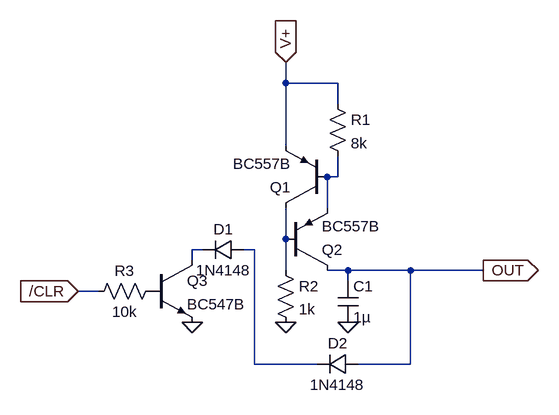
[diagram p0: schematic RampGen.asc]
RampGen.asc, the LTspice schematic file:
Version 4
SHEET 1 1276 1184
WIRE 832 -64 832 -96
WIRE 912 -64 832 -64
WIRE 912 -32 912 -64
WIRE 832 32 832 -64
WIRE 912 80 912 48
WIRE 912 80 896 80
WIRE 896 128 896 80
WIRE 832 176 832 128
WIRE 704 192 688 192
WIRE 784 192 768 192
WIRE 688 208 688 192
WIRE 832 224 832 176
WIRE 928 224 896 224
WIRE 1024 224 928 224
WIRE 1136 224 1024 224
WIRE 928 240 928 224
WIRE 544 256 512 256
WIRE 784 368 784 192
WIRE 880 368 784 368
WIRE 1024 368 1024 224
WIRE 1024 368 944 368
FLAG 688 304 0
FLAG 512 256 /CLR
IOPIN 512 256 In
FLAG 832 304 0
FLAG 832 -96 V+
IOPIN 832 -96 In
FLAG 928 304 0
FLAG 1136 224 OUT
IOPIN 1136 224 Out
SYMBOL npn 624 208 R0
SYMATTR InstName Q3
SYMATTR Value BC547B
SYMBOL res 640 240 R90
WINDOW 0 0 56 VBottom 2
WINDOW 3 32 56 VTop 2
SYMATTR InstName R3
SYMATTR Value 10k
SYMBOL pnp 832 224 M180
SYMATTR InstName Q2
SYMATTR Value BC557B
SYMBOL pnp 896 128 R180
SYMATTR InstName Q1
SYMATTR Value BC557B
SYMBOL res 816 208 R0
SYMATTR InstName R2
SYMATTR Value 1k
SYMBOL cap 912 240 R0
SYMATTR InstName C1
SYMATTR Value 1µ
SYMBOL res 896 -48 R0
SYMATTR InstName R1
SYMATTR Value 8k
SYMBOL diode 768 176 R90
WINDOW 0 0 32 VBottom 2
WINDOW 3 32 32 VTop 2
SYMATTR InstName D1
SYMATTR Value 1N4148
SYMBOL diode 944 352 R90
WINDOW 0 0 32 VBottom 2
WINDOW 3 32 32 VTop 2
SYMATTR InstName D2
SYMATTR Value 1N4148

The netlist it stands for:
* RampGen.asc
Q3 N003 P001 0 0 BC547B
R3 P001 /CLR 10k
Q2 OUT N002 N001 0 BC557B
Q1 N002 N001 V+ 0 BC557B
R2 N002 0 1k
C1 OUT 0 1µ
R1 V+ N001 8k
D1 N004 N003 1N4148
D2 OUT N004 1N4148
.model D D
.lib standard.dio
.model NPN NPN
.model PNP PNP
.lib standard.bjt
.backanno
.end